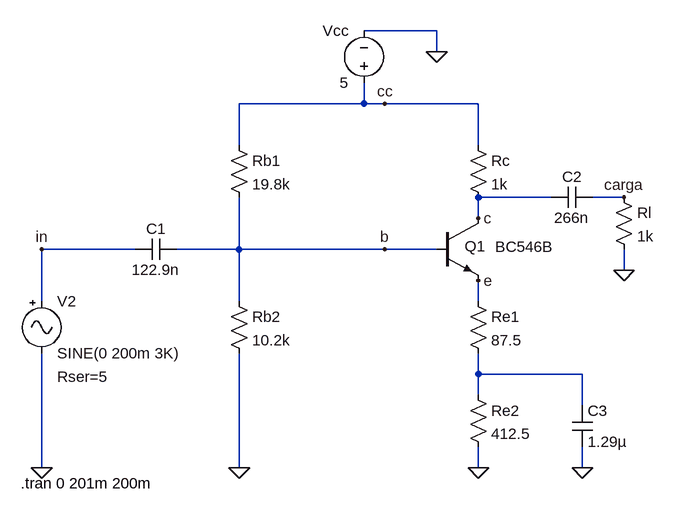
[diagram p0: schematic P2 - Class-A Transistor Amplifier.asc]
P2 - Class-A Transistor Amplifier.asc, the LTspice schematic file:
Version 4
SHEET 1 880 680
WIRE 368 -192 256 -192
WIRE 368 -160 368 -192
WIRE 256 -80 256 -112
WIRE 256 -80 64 -80
WIRE 288 -80 256 -80
WIRE 432 -80 288 -80
WIRE 64 -16 64 -80
WIRE 432 -16 432 -80
WIRE 544 64 432 64
WIRE 656 64 608 64
WIRE 432 96 432 64
WIRE -96 144 -240 144
WIRE 64 144 64 64
WIRE 64 144 -32 144
WIRE 288 144 64 144
WIRE 368 144 288 144
WIRE 656 176 656 144
WIRE -240 224 -240 144
WIRE 64 224 64 144
WIRE 432 224 432 192
WIRE 432 336 432 304
WIRE 592 336 432 336
WIRE 432 368 432 336
WIRE 592 384 592 336
WIRE -240 480 -240 304
WIRE 64 480 64 304
WIRE 432 480 432 448
WIRE 592 480 592 448
FLAG 592 480 0
FLAG 432 480 0
FLAG 64 480 0
FLAG -240 480 0
FLAG 368 -160 0
FLAG 656 176 0
FLAG -240 144 in
FLAG 656 64 carga
FLAG 288 144 b
FLAG 432 96 c
FLAG 432 192 e
FLAG 288 -80 cc
SYMBOL res 48 -32 R0
SYMATTR InstName Rb1
SYMATTR Value 19.8k
SYMBOL res 48 208 R0
SYMATTR InstName Rb2
SYMATTR Value 10.2k
SYMBOL res 416 -32 R0
SYMATTR InstName Rc
SYMATTR Value 1k
SYMBOL res 416 208 R0
SYMATTR InstName Re1
SYMATTR Value 87.5
SYMBOL res 416 352 R0
SYMATTR InstName Re2
SYMATTR Value 412.5
SYMBOL cap -32 128 R90
WINDOW 0 0 32 VBottom 2
WINDOW 3 32 32 VTop 2
SYMATTR InstName C1
SYMATTR Value 122.9n
SYMBOL cap 608 48 R90
WINDOW 0 0 32 VBottom 2
WINDOW 3 32 32 VTop 2
SYMATTR InstName C2
SYMATTR Value 266n
SYMBOL cap 576 384 R0
SYMATTR InstName C3
SYMATTR Value 1.29µ
SYMBOL npn 368 96 R0
WINDOW 0 43 43 Left 2
WINDOW 3 90 44 Left 2
SYMATTR InstName Q1
SYMATTR Value BC546B
SYMBOL voltage 256 -96 R180
WINDOW 0 24 96 Left 2
WINDOW 3 24 16 Left 2
WINDOW 123 0 0 Left 0
WINDOW 39 0 0 Left 0
SYMATTR InstName Vcc
SYMATTR Value 5
SYMBOL Misc\\signal -240 208 R0
WINDOW 123 0 0 Left 0
WINDOW 39 24 132 Left 2
SYMATTR SpiceLine Rser=5
SYMATTR InstName V2
SYMATTR Value SINE(0 200m 3K)
SYMBOL res 640 48 R0
SYMATTR InstName Rl
SYMATTR Value 1k
TEXT -272 504 Left 2 !.tran 0 201m 200m

The netlist it stands for:
* P2 - Class-A Transistor Amplifier.asc
Rb1 cc b 19.8k
Rb2 b 0 10.2k
Rc cc c 1k
Re1 e N001 87.5
Re2 N001 0 412.5
C1 b in 122.9n
C2 carga c 266n
C3 N001 0 1.29µ
Q1 c b e 0 BC546B
Vcc cc 0 5
V2 in 0 SINE(0 200m 3K) Rser=5
Rl carga 0 1k
.model NPN NPN
.model PNP PNP
.lib standard.bjt
.tran 0 201m 200m
.backanno
.end